# EAGLE design Posibus (EAGLE 6.6.0)
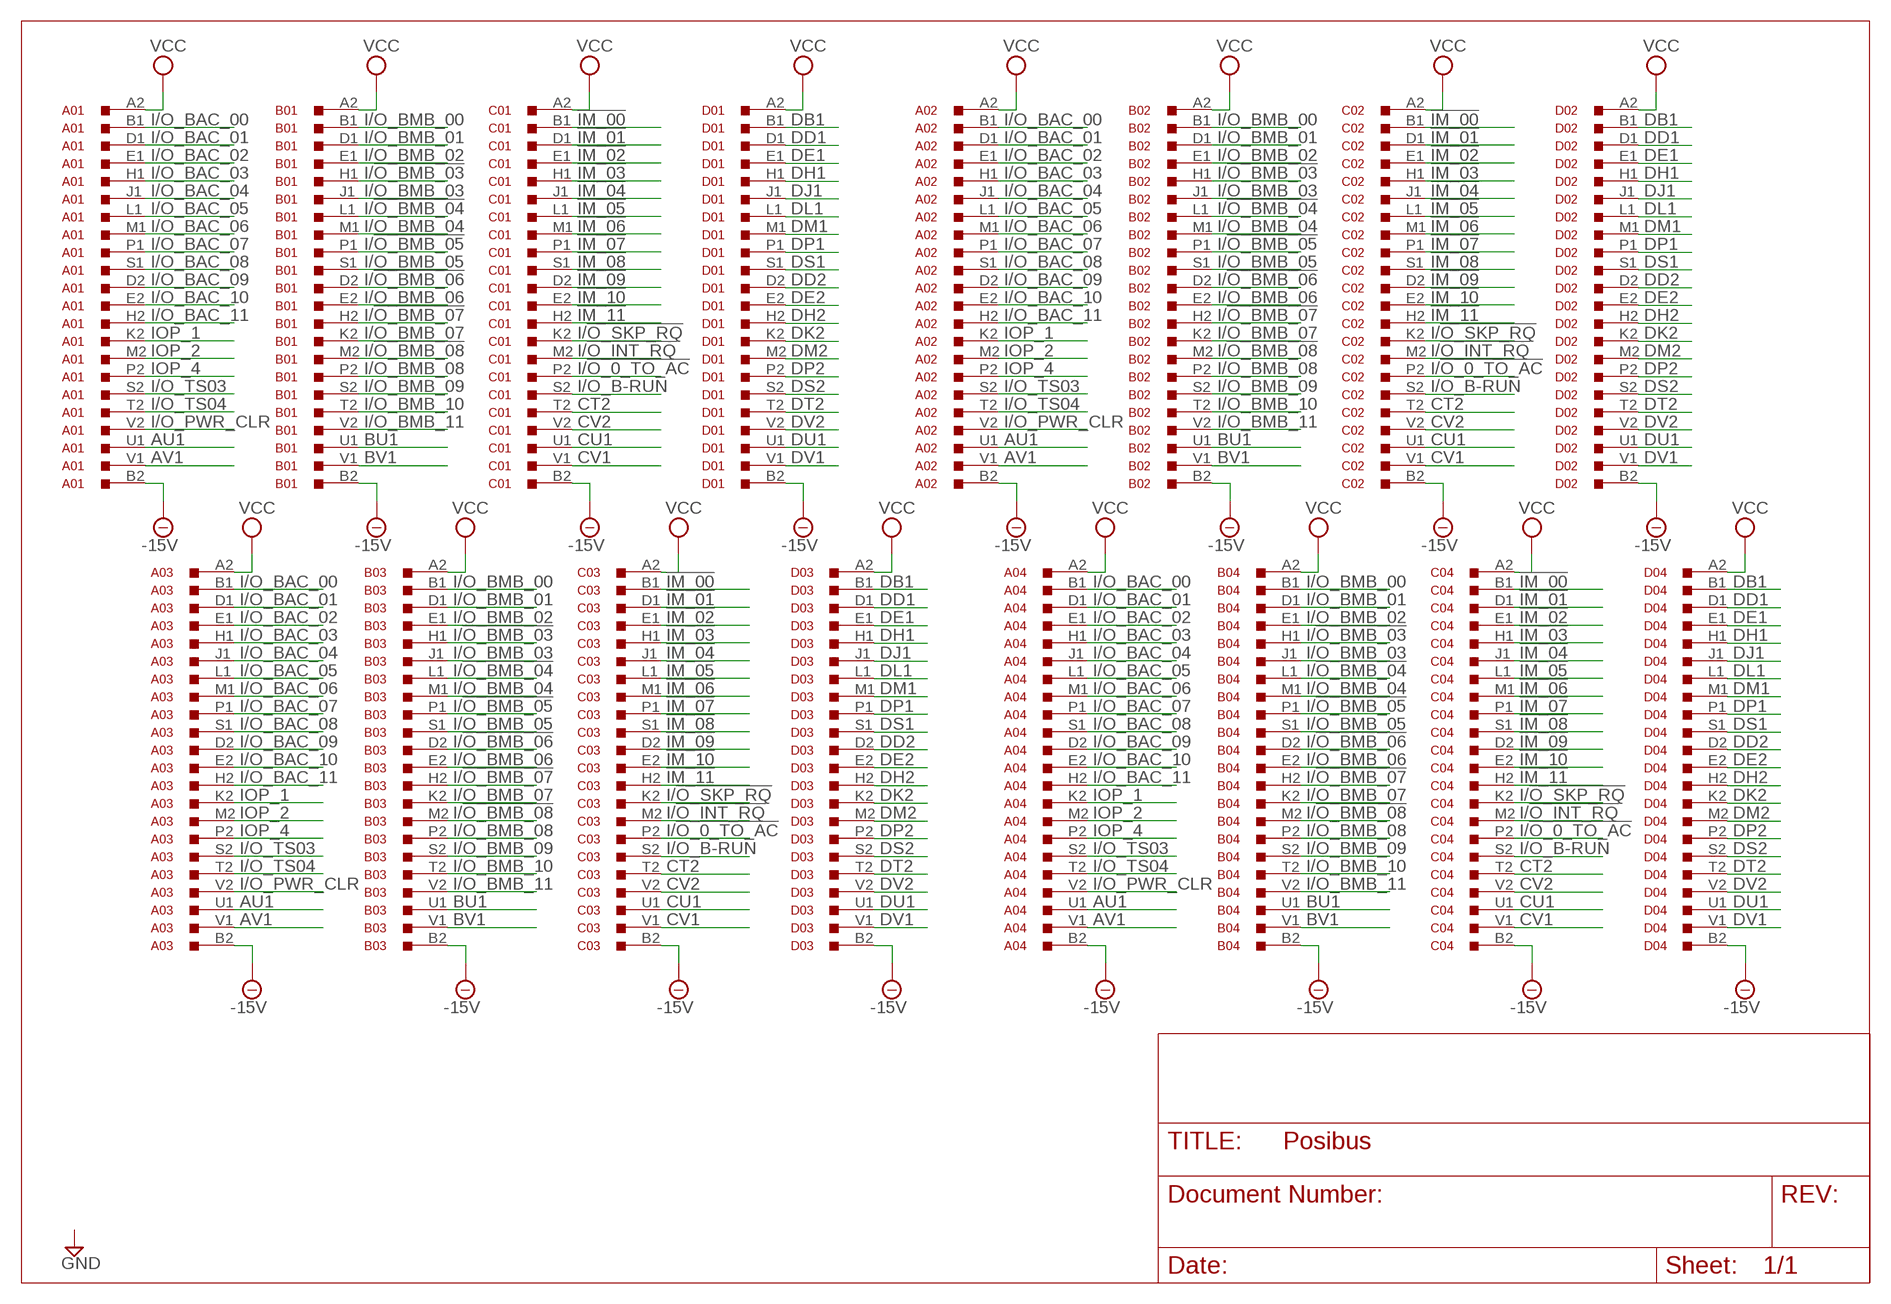
[diagram p0: schematic, sheet 1]

## Parts
A01  M903  [H807]
A02  M903  [H807]
A03  M903  [H807]
A04  M903  [H807]
B01  M903  [H807]
B02  M903  [H807]
B03  M903  [H807]
B04  M903  [H807]
C01  M903  [H807]
C02  M903  [H807]
C03  M903  [H807]
C04  M903  [H807]
D01  M903  [H807]
D02  M903  [H807]
D03  M903  [H807]
D04  M903  [H807]

## Nets
!IM_00: C01.B1 C02.B1 C03.B1 C04.B1
!IM_01: C01.D1 C02.D1 C03.D1 C04.D1
!IM_02: C01.E1 C02.E1 C03.E1 C04.E1
!IM_03: C01.H1 C02.H1 C03.H1 C04.H1
!IM_04: C01.J1 C02.J1 C03.J1 C04.J1
!IM_05: C01.L1 C02.L1 C03.L1 C04.L1
!IM_06: C01.M1 C02.M1 C03.M1 C04.M1
!IM_07: C01.P1 C02.P1 C03.P1 C04.P1
!IM_08: C01.S1 C02.S1 C03.S1 C04.S1
!IM_09: C01.D2 C02.D2 C03.D2 C04.D2
!IM_10: C01.E2 C02.E2 C03.E2 C04.E2
!IM_11: C01.H2 C02.H2 C03.H2 C04.H2
-15V: A01.B2 A02.B2 A03.B2 A04.B2 B01.B2 B02.B2 B03.B2 B04.B2 C01.B2 C02.B2 C03.B2 C04.B2 D01.B2 D02.B2 D03.B2 D04.B2
AU1: A01.U1 A02.U1 A03.U1 A04.U1
AV1: A01.V1 A02.V1 A03.V1 A04.V1
BU1: B01.U1 B02.U1 B03.U1 B04.U1
BV1: B01.V1 B02.V1 B03.V1 B04.V1
CT2: C01.T2 C02.T2 C03.T2 C04.T2
CU1: C01.U1 C02.U1 C03.U1 C04.U1
CV1: C01.V1 C02.V1 C03.V1 C04.V1
CV2: C01.V2 C02.V2 C03.V2 C04.V2
DB1: D01.B1 D02.B1 D03.B1 D04.B1
DD1: D01.D1 D02.D1 D03.D1 D04.D1
DD2: D01.D2 D02.D2 D03.D2 D04.D2
DE1: D01.E1 D02.E1 D03.E1 D04.E1
DE2: D01.E2 D02.E2 D03.E2 D04.E2
DH1: D01.H1 D02.H1 D03.H1 D04.H1
DH2: D01.H2 D02.H2 D03.H2 D04.H2
DJ1: D01.J1 D02.J1 D03.J1 D04.J1
DK2: D01.K2 D02.K2 D03.K2 D04.K2
DL1: D01.L1 D02.L1 D03.L1 D04.L1
DM1: D01.M1 D02.M1 D03.M1 D04.M1
DM2: D01.M2 D02.M2 D03.M2 D04.M2
DP1: D01.P1 D02.P1 D03.P1 D04.P1
DP2: D01.P2 D02.P2 D03.P2 D04.P2
DS1: D01.S1 D02.S1 D03.S1 D04.S1
DS2: D01.S2 D02.S2 D03.S2 D04.S2
DT2: D01.T2 D02.T2 D03.T2 D04.T2
DU1: D01.U1 D02.U1 D03.U1 D04.U1
DV1: D01.V1 D02.V1 D03.V1 D04.V1
DV2: D01.V2 D02.V2 D03.V2 D04.V2
I/!O_0_TO_AC: C01.P2 C02.P2 C03.P2 C04.P2
I/!O_BMB_03: B01.H1 B02.H1 B03.H1 B04.H1
I/!O_BMB_04: B01.L1 B02.L1 B03.L1 B04.L1
I/!O_BMB_05: B01.P1 B02.P1 B03.P1 B04.P1
I/!O_BMB_06: B01.D2 B02.D2 B03.D2 B04.D2
I/!O_BMB_07: B01.H2 B02.H2 B03.H2 B04.H2
I/!O_BMB_08: B01.M2 B02.M2 B03.M2 B04.M2
I/!O_INT_RQ: C01.M2 C02.M2 C03.M2 C04.M2
I/!O_SKP_RQ: C01.K2 C02.K2 C03.K2 C04.K2
I/O_B-RUN: C01.S2 C02.S2 C03.S2 C04.S2
I/O_BAC_00: A01.B1 A02.B1 A03.B1 A04.B1
I/O_BAC_01: A01.D1 A02.D1 A03.D1 A04.D1
I/O_BAC_02: A01.E1 A02.E1 A03.E1 A04.E1
I/O_BAC_03: A01.H1 A02.H1 A03.H1 A04.H1
I/O_BAC_04: A01.J1 A02.J1 A03.J1 A04.J1
I/O_BAC_05: A01.L1 A02.L1 A03.L1 A04.L1
I/O_BAC_06: A01.M1 A02.M1 A03.M1 A04.M1
I/O_BAC_07: A01.P1 A02.P1 A03.P1 A04.P1
I/O_BAC_08: A01.S1 A02.S1 A03.S1 A04.S1
I/O_BAC_09: A01.D2 A02.D2 A03.D2 A04.D2
I/O_BAC_10: A01.E2 A02.E2 A03.E2 A04.E2
I/O_BAC_11: A01.H2 A02.H2 A03.H2 A04.H2
I/O_BMB_00: B01.B1 B02.B1 B03.B1 B04.B1
I/O_BMB_01: B01.D1 B02.D1 B03.D1 B04.D1
I/O_BMB_02: B01.E1 B02.E1 B03.E1 B04.E1
I/O_BMB_03: B01.J1 B02.J1 B03.J1 B04.J1
I/O_BMB_04: B01.M1 B02.M1 B03.M1 B04.M1
I/O_BMB_05: B01.S1 B02.S1 B03.S1 B04.S1
I/O_BMB_06: B01.E2 B02.E2 B03.E2 B04.E2
I/O_BMB_07: B01.K2 B02.K2 B03.K2 B04.K2
I/O_BMB_08: B01.P2 B02.P2 B03.P2 B04.P2
I/O_BMB_09: B01.S2 B02.S2 B03.S2 B04.S2
I/O_BMB_10: B01.T2 B02.T2 B03.T2 B04.T2
I/O_BMB_11: B01.V2 B02.V2 B03.V2 B04.V2
I/O_PWR_CLR: A01.V2 A02.V2 A03.V2 A04.V2
I/O_TS03: A01.S2 A02.S2 A03.S2 A04.S2
I/O_TS04: A01.T2 A02.T2 A03.T2 A04.T2
IOP_1: A01.K2 A02.K2 A03.K2 A04.K2
IOP_2: A01.M2 A02.M2 A03.M2 A04.M2
IOP_4: A01.P2 A02.P2 A03.P2 A04.P2
VCC: A01.A2 A02.A2 A03.A2 A04.A2 B01.A2 B02.A2 B03.A2 B04.A2 C01.A2 C02.A2 C03.A2 C04.A2 D01.A2 D02.A2 D03.A2 D04.A2

## Power pins joined to a net without a drawn wire
GND: A01.A1 A01.C1 A01.C2 A01.F1 A01.F2 A01.J2 A01.K1 A01.L2 A01.N1 A01.N2 A01.R1 A01.R2 A01.T1 A01.U2 A02.A1 A02.C1 A02.C2 A02.F1 A02.F2 A02.J2 A02.K1 A02.L2 A02.N1 A02.N2 A02.R1 A02.R2 A02.T1 A02.U2 A03.A1 A03.C1 A03.C2 A03.F1 A03.F2 A03.J2 A03.K1 A03.L2 A03.N1 A03.N2 A03.R1 A03.R2 A03.T1 A03.U2 A04.A1 A04.C1 A04.C2 A04.F1 A04.F2 A04.J2 A04.K1 A04.L2 A04.N1 A04.N2 A04.R1 A04.R2 A04.T1 A04.U2 B01.A1 B01.C1 B01.C2 B01.F1 B01.F2 B01.J2 B01.K1 B01.L2 B01.N1 B01.N2 B01.R1 B01.R2 B01.T1 B01.U2 B02.A1 B02.C1 B02.C2 B02.F1 B02.F2 B02.J2 B02.K1 B02.L2 B02.N1 B02.N2 B02.R1 B02.R2 B02.T1 B02.U2 B03.A1 B03.C1 B03.C2 B03.F1 B03.F2 B03.J2 B03.K1 B03.L2 B03.N1 B03.N2 B03.R1 B03.R2 B03.T1 B03.U2 B04.A1 B04.C1 B04.C2 B04.F1 B04.F2 B04.J2 B04.K1 B04.L2 B04.N1 B04.N2 B04.R1 B04.R2 B04.T1 B04.U2 C01.A1 C01.C1 C01.C2 C01.F1 C01.F2 C01.J2 C01.K1 C01.L2 C01.N1 C01.N2 C01.R1 C01.R2 C01.T1 C01.U2 C02.A1 C02.C1 C02.C2 C02.F1 C02.F2 C02.J2 C02.K1 C02.L2 C02.N1 C02.N2 C02.R1 C02.R2 C02.T1 C02.U2 C03.A1 C03.C1 C03.C2 C03.F1 C03.F2 C03.J2 C03.K1 C03.L2 C03.N1 C03.N2 C03.R1 C03.R2 C03.T1 C03.U2 C04.A1 C04.C1 C04.C2 C04.F1 C04.F2 C04.J2 C04.K1 C04.L2 C04.N1 C04.N2 C04.R1 C04.R2 C04.T1 C04.U2 D01.A1 D01.C1 D01.C2 D01.F1 D01.F2 D01.J2 D01.K1 D01.L2 D01.N1 D01.N2 D01.R1 D01.R2 D01.T1 D01.U2 D02.A1 D02.C1 D02.C2 D02.F1 D02.F2 D02.J2 D02.K1 D02.L2 D02.N1 D02.N2 D02.R1 D02.R2 D02.T1 D02.U2 D03.A1 D03.C1 D03.C2 D03.F1 D03.F2 D03.J2 D03.K1 D03.L2 D03.N1 D03.N2 D03.R1 D03.R2 D03.T1 D03.U2 D04.A1 D04.C1 D04.C2 D04.F1 D04.F2 D04.J2 D04.K1 D04.L2 D04.N1 D04.N2 D04.R1 D04.R2 D04.T1 D04.U2

## Library data of the parts
A01-A04 B01-B04 C01-C04 D01-D04 = dec-m:M903: Two-sided Posibus cable/connector.

## Net classes
0 default: width 0.762 mm
1 Power: width 0.762 mm, drill 0.381 mm, clearance 0.381 mm

## Board
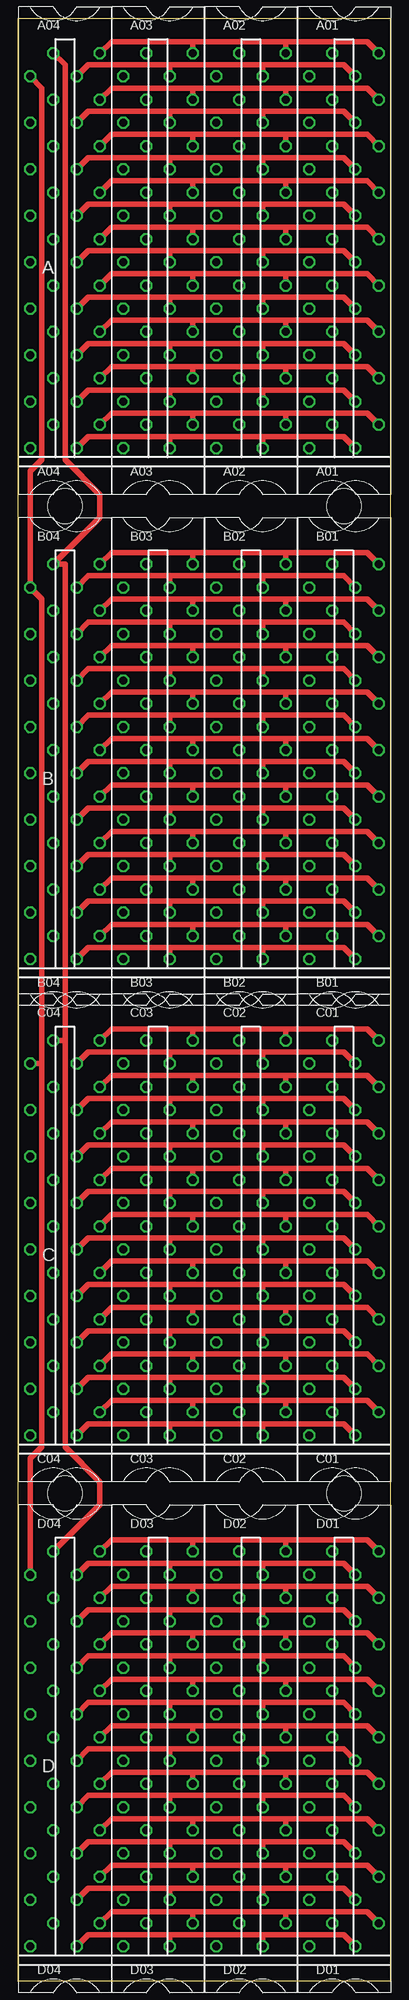
[diagram p1: board, top side]
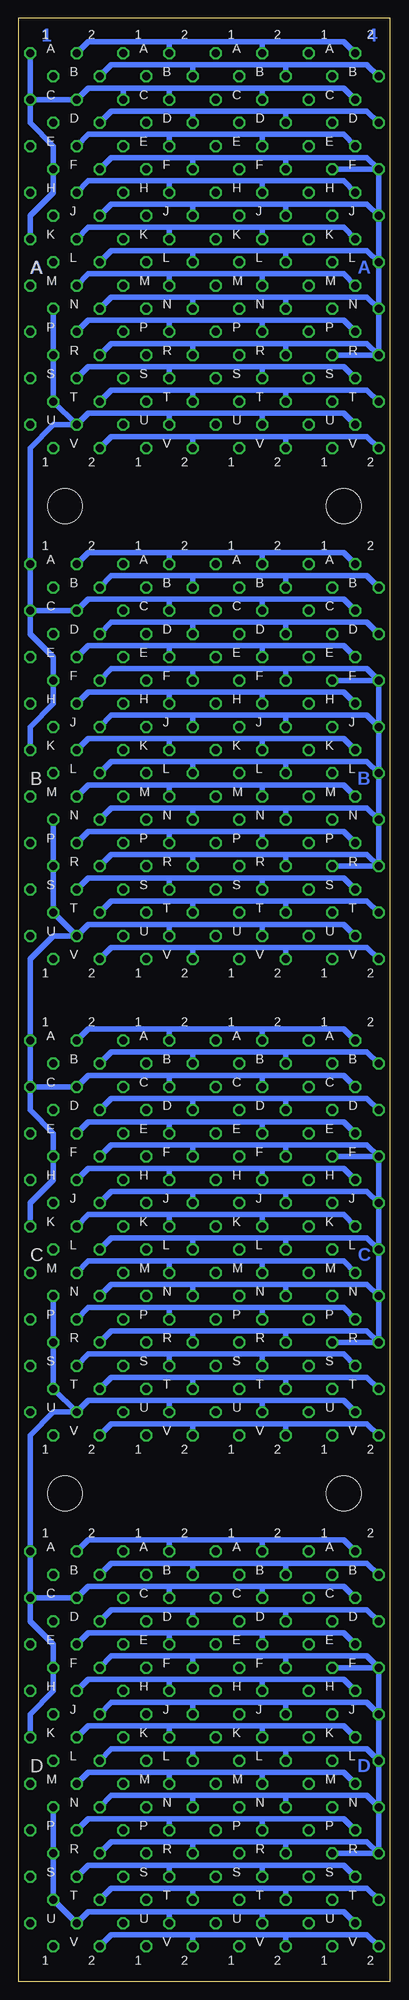
[diagram p2: board, bottom side, seen from below]

Size 50.86 x 268.27 mm. Coordinates in mm from the lower left corner, seen from the top.
Outline: 50.83,0 0,0 0.03,268.26 50.86,268.28 50.83,0
Copper layers (1*16): Top 0.035mm / dielectric 1.5mm / Bottom 0.035mm
Design rules "10mils *": minimum track width 10mil, minimum drill 24mil, track to track 10mil, track to pad 10mil, pad to pad 10mil, via to via 10mil, smd to smd 10mil, copper to edge 25mil, drill to drill 10mil, minimum pad ring 10mil, minimum via ring 8mil, stop-mask expansion 0mil, vias tented up to drill 0mil, thermal gap 10mil
Holes 4.76 mm at 44.49,201.6 6.39,201.6 6.39,66.66 44.49,66.66

### Footprints (pad centres in the part's own frame; a part is rotated, then mirrored left to right if it is on the bottom)
H807 = drill 1.092 octagon: A1 4.763,28.575; A2 -1.587,28.575; B1 1.587,25.4; B2 -4.763,25.4; C1 4.763,22.225; C2 -1.587,22.225; D1 1.587,19.05; D2 -4.763,19.05; E1 4.763,15.875; E2 -1.587,15.875; F1 1.587,12.7; F2 -4.763,12.7; H1 4.763,9.525; H2 -1.587,9.525; J1 1.587,6.35; J2 -4.763,6.35; K1 4.763,3.175; K2 -1.587,3.175; L1 1.587,0; L2 -4.763,0; M1 4.763,-3.175; M2 -1.587,-3.175; N1 1.587,-6.35; N2 -4.763,-6.35; P1 4.763,-9.525; P2 -1.587,-9.525; R1 1.587,-12.7; R2 -4.763,-12.7; S1 4.763,-15.875; S2 -1.587,-15.875; T1 1.587,-19.05; T2 -4.763,-19.05; U1 4.763,-22.225; U2 -1.587,-22.225; V1 1.587,-25.4; V2 -4.763,-25.4

### Placement (x,y rotation side)
A01  44.49,234.94 0 top
A02  31.79,234.94 0 top
A03  19.09,234.94 0 top
A04  6.39,234.94 0 top
B01  44.49,165.09 0 top
B02  31.79,165.09 0 top
B03  19.09,165.09 0 top
B04  6.39,165.09 0 top
C01  44.49,100 0 top
C02  31.79,100 0 top
C03  19.09,100 0 top
C04  6.39,100 0 top
D01  44.49,30.15 0 top
D02  31.79,30.15 0 top
D03  19.09,30.15 0 top
D04  6.39,30.15 0 top

### Tracks (layer width: path | path; a pad name or v marks a point on that pad's centre or on a via)
!IM_00
  Top 0.762: C04.B1 9.56,126.99 20.67,126.99 | 20.67,126.99 33.37,126.99 | 33.37,126.99 44.49,126.99 C01.B1 | C02.B1 33.37,126.99 | C03.B1 20.67,126.99
!IM_01
  Top 0.762: C04.D1 9.56,120.64 20.67,120.64 | 20.67,120.64 33.37,120.64 | 33.37,120.64 44.49,120.64 C01.D1 | C03.D1 20.67,120.64 | C02.D1 33.37,120.64
!IM_02
  Top 0.762: C04.E1 12.74,117.46 23.85,117.46 | 23.85,117.46 36.55,117.46 | 36.55,117.46 47.66,117.46 C01.E1 | C03.E1 23.85,117.46 | C02.E1 36.55,117.46
!IM_03
  Top 0.762: C01.H1 47.66,111.11 36.55,111.11 | 36.55,111.11 23.85,111.11 | 23.85,111.11 12.74,111.11 C04.H1 | C02.H1 36.55,111.11 | C03.H1 23.85,111.11
!IM_04
  Top 0.762: C04.J1 9.56,107.94 20.67,107.94 | 20.67,107.94 33.37,107.94 | 33.37,107.94 44.49,107.94 C01.J1 | C02.J1 33.37,107.94 | C03.J1 20.67,107.94
!IM_05
  Top 0.762: C04.L1 9.56,101.59 20.67,101.59 | 20.67,101.59 33.37,101.59 | 33.37,101.59 44.49,101.59 C01.L1 | C02.L1 33.37,101.59 | C03.L1 20.67,101.59
!IM_06
  Top 0.762: C01.M1 47.66,98.41 36.55,98.41 | 36.55,98.41 23.85,98.41 | 23.85,98.41 12.74,98.41 C04.M1 | C02.M1 36.55,98.41 | C03.M1 23.85,98.41
!IM_07
  Top 0.762: C04.P1 12.74,92.06 23.85,92.06 | 23.85,92.06 36.55,92.06 | 36.55,92.06 47.66,92.06 C01.P1 | C02.P1 36.55,92.06 | C03.P1 23.85,92.06
!IM_08
  Top 0.762: C01.S1 47.66,85.71 36.55,85.71 | 36.55,85.71 23.85,85.71 | 23.85,85.71 12.74,85.71 C04.S1 | C02.S1 36.55,85.71 | C03.S1 23.85,85.71
!IM_09
  Bottom 0.762: C04.D2 3.21,120.64 14.32,120.64 | 14.32,120.64 27.02,120.64 | 27.02,120.64 38.14,120.64 C01.D2 | C03.D2 14.32,120.64 | C02.D2 27.02,120.64
!IM_10
  Bottom 0.762: C04.E2 6.39,117.46 17.5,117.46 | 17.5,117.46 30.2,117.46 | 30.2,117.46 41.31,117.46 C01.E2 | C03.E2 17.5,117.46 | C02.E2 30.2,117.46
!IM_11
  Bottom 0.762: C01.H2 41.31,111.11 30.2,111.11 | 30.2,111.11 17.5,111.11 | 17.5,111.11 6.39,111.11 C04.H2 | C03.H2 17.5,111.11 | C02.H2 30.2,111.11
-15V
  Top 0.762: A04.B2 3.21,258.75 3.21,207.95 1.62,206.36 B04.B2 3.21,188.9 3.21,125.4 | D04.B2 1.62,71.43 3.21,73.01 3.21,125.4 | 3.21,125.4 C04.B2
  Bottom 0.762: 3.21,261.93 14.32,261.93 | 14.32,261.93 27.02,261.93 | 27.02,261.93 38.14,261.93 A01.B2 | A02.B2 27.02,261.93 | A03.B2 14.32,261.93 | D04.B2 3.21,57.14 14.32,57.14 | 14.32,57.14 27.02,57.14 | 27.02,57.14 38.14,57.14 D01.B2 | C04.B2 3.21,126.99 14.32,126.99 | 14.32,126.99 27.02,126.99 | 27.02,126.99 38.14,126.99 C01.B2 | B01.B2 38.14,192.08 27.02,192.08 | 27.02,192.08 14.32,192.08 | 14.32,192.08 3.21,192.08 B04.B2 | B03.B2 14.32,192.08 | B02.B2 27.02,192.08 | D02.B2 27.02,57.14 | D03.B2 14.32,57.14 | C03.B2 14.32,126.99 | C02.B2 27.02,126.99
  Bottom 0.813: A04.B2 3.21,261.93
AU1
  Top 0.762: A04.U1 12.74,214.3 23.85,214.3 | 23.85,214.3 36.55,214.3 | 36.55,214.3 47.66,214.3 A01.U1 | A02.U1 36.55,214.3 | A03.U1 23.85,214.3
AV1
  Top 0.762: A04.V1 9.56,211.12 20.67,211.12 | 20.67,211.12 33.37,211.12 | 33.37,211.12 44.49,211.12 A01.V1 | A03.V1 20.67,211.12 | A02.V1 33.37,211.12
BU1
  Top 0.762: B01.U1 47.66,144.45 36.55,144.45 | 36.55,144.45 23.85,144.45 | 23.85,144.45 12.74,144.45 B04.U1 | B02.U1 36.55,144.45 | B03.U1 23.85,144.45
BV1
  Top 0.762: B04.V1 9.56,141.27 20.67,141.27 | 20.67,141.27 33.37,141.27 | 33.37,141.27 44.49,141.27 B01.V1 | B03.V1 20.67,141.27 | B02.V1 33.37,141.27
CT2
  Bottom 0.762: C04.T2 3.21,82.54 14.32,82.54 | 14.32,82.54 27.02,82.54 | 27.02,82.54 38.14,82.54 C01.T2 | C03.T2 14.32,82.54 | C02.T2 27.02,82.54
CU1
  Top 0.762: C01.U1 47.66,79.36 36.55,79.36 | 36.55,79.36 23.85,79.36 | 23.85,79.36 12.74,79.36 C04.U1 | C02.U1 36.55,79.36 | C03.U1 23.85,79.36
CV1
  Top 0.762: C04.V1 9.56,76.19 20.67,76.19 | 20.67,76.19 33.37,76.19 | 33.37,76.19 44.49,76.19 C01.V1 | C02.V1 33.37,76.19 | C03.V1 20.67,76.19
CV2
  Bottom 0.762: C04.V2 3.21,76.19 14.32,76.19 | 14.32,76.19 27.02,76.19 | 27.02,76.19 38.14,76.19 C01.V2 | C03.V2 14.32,76.19 | C02.V2 27.02,76.19
DB1
  Top 0.762: D04.B1 9.56,57.14 20.67,57.14 | 20.67,57.14 33.37,57.14 | 33.37,57.14 44.49,57.14 D01.B1 | D03.B1 20.67,57.14 | D02.B1 33.37,57.14
DD1
  Top 0.762: D01.D1 44.49,50.79 33.37,50.79 | 33.37,50.79 20.67,50.79 | 20.67,50.79 9.56,50.79 D04.D1 | D03.D1 20.67,50.79 | D02.D1 33.37,50.79
DD2
  Bottom 0.762: D04.D2 3.21,50.79 14.32,50.79 | 14.32,50.79 27.02,50.79 | 27.02,50.79 38.14,50.79 D01.D2 | D02.D2 27.02,50.79 | D03.D2 14.32,50.79
DE1
  Top 0.762: D04.E1 12.74,47.61 23.85,47.61 | 23.85,47.61 36.55,47.61 | 36.55,47.61 47.66,47.61 D01.E1 | D03.E1 23.85,47.61 | D02.E1 36.55,47.61
DE2
  Bottom 0.762: D04.E2 6.39,47.61 17.5,47.61 | 17.5,47.61 30.2,47.61 | 30.2,47.61 41.31,47.61 D01.E2 | D03.E2 17.5,47.61 | D02.E2 30.2,47.61
DH1
  Top 0.762: D01.H1 47.66,41.26 36.55,41.26 | 36.55,41.26 23.85,41.26 | 23.85,41.26 12.74,41.26 D04.H1 | D03.H1 23.85,41.26 | D02.H1 36.55,41.26
DH2
  Bottom 0.762: D04.H2 6.39,41.26 17.5,41.26 | 17.5,41.26 30.2,41.26 | 30.2,41.26 41.31,41.26 D01.H2 | D03.H2 17.5,41.26 | D02.H2 30.2,41.26
DJ1
  Top 0.762: D04.J1 9.56,38.09 20.67,38.09 | 20.67,38.09 33.37,38.09 | 33.37,38.09 44.49,38.09 D01.J1 | D03.J1 20.67,38.09 | D02.J1 33.37,38.09
DK2
  Bottom 0.762: D04.K2 6.39,34.91 17.5,34.91 | 17.5,34.91 30.2,34.91 | 30.2,34.91 41.31,34.91 D01.K2 | D03.K2 17.5,34.91 | D02.K2 30.2,34.91
DL1
  Top 0.762: D04.L1 9.56,31.74 20.67,31.74 | 20.67,31.74 33.37,31.74 | 33.37,31.74 44.49,31.74 D01.L1 | D03.L1 20.67,31.74 | D02.L1 33.37,31.74
DM1
  Top 0.762: D04.M1 12.74,28.56 23.85,28.56 | 23.85,28.56 36.55,28.56 | 36.55,28.56 47.66,28.56 D01.M1 | D03.M1 23.85,28.56 | D02.M1 36.55,28.56
DM2
  Bottom 0.762: D04.M2 6.39,28.56 17.5,28.56 | 17.5,28.56 30.2,28.56 | 30.2,28.56 41.31,28.56 D01.M2 | D03.M2 17.5,28.56 | D02.M2 30.2,28.56
DP1
  Top 0.762: D01.P1 47.66,22.21 36.55,22.21 | 36.55,22.21 23.85,22.21 | 23.85,22.21 12.74,22.21 D04.P1 | D03.P1 23.85,22.21 | D02.P1 36.55,22.21
DP2
  Bottom 0.762: D04.P2 6.39,22.21 17.5,22.21 | 17.5,22.21 30.2,22.21 | 30.2,22.21 41.31,22.21 D01.P2 | D03.P2 17.5,22.21 | D02.P2 30.2,22.21
DS1
  Top 0.762: D01.S1 47.66,15.86 36.55,15.86 | 36.55,15.86 23.85,15.86 | 23.85,15.86 12.74,15.86 D04.S1 | D03.S1 23.85,15.86 | D02.S1 36.55,15.86
DS2
  Bottom 0.762: D04.S2 6.39,15.86 17.5,15.86 | 17.5,15.86 30.2,15.86 | 30.2,15.86 41.31,15.86 D01.S2 | D03.S2 17.5,15.86 | D02.S2 30.2,15.86
DT2
  Bottom 0.762: D04.T2 3.21,12.69 14.32,12.69 | 14.32,12.69 27.02,12.69 | 27.02,12.69 38.14,12.69 D01.T2 | D02.T2 27.02,12.69 | D03.T2 14.32,12.69
DU1
  Top 0.762: D04.U1 12.74,9.51 23.85,9.51 | 23.85,9.51 36.55,9.51 | 36.55,9.51 47.66,9.51 D01.U1 | D03.U1 23.85,9.51 | D02.U1 36.55,9.51
DV1
  Top 0.762: D04.V1 9.56,6.34 20.67,6.34 | 20.67,6.34 33.37,6.34 | 33.37,6.34 44.49,6.34 D01.V1 | D03.V1 20.67,6.34 | D02.V1 33.37,6.34
DV2
  Bottom 0.762: D04.V2 3.21,6.34 14.32,6.34 | 14.32,6.34 27.02,6.34 | 27.02,6.34 38.14,6.34 D01.V2 | D02.V2 27.02,6.34 | D03.V2 14.32,6.34
GND
  Top 0.762: A04.T1 9.56,217.48 20.67,217.48 | 20.67,217.48 33.37,217.48 | 33.37,217.48 44.49,217.48 A01.T1 | A04.R1 9.56,223.83 20.67,223.83 | 20.67,223.83 33.37,223.83 | 33.37,223.83 44.49,223.83 A01.R1 | A02.T1 33.37,217.48 | A03.T1 20.67,217.48 | A03.R1 20.67,223.83 | A02.R1 33.37,223.83 | A04.N1 9.56,230.18 20.67,230.18 | 20.67,230.18 33.37,230.18 | 33.37,230.18 44.49,230.18 A01.N1 | A04.F1 9.56,249.23 20.67,249.23 | 20.67,249.23 33.37,249.23 | 33.37,249.23 44.49,249.23 A01.F1 | A04.A1 12.74,265.1 23.85,265.1 | 23.85,265.1 36.55,265.1 | 36.55,265.1 47.66,265.1 A01.A1 | A04.C1 12.74,258.75 23.85,258.75 | 23.85,258.75 36.55,258.75 | 36.55,258.75 47.66,258.75 A01.C1 | A03.C1 23.85,258.75 | A02.C1 36.55,258.75 | A03.A1 23.85,265.1 | A02.A1 36.55,265.1 | A03.F1 20.67,249.23 | A02.F1 33.37,249.23 | A01.K1 47.66,239.7 36.55,239.7 | 36.55,239.7 23.85,239.7 | 23.85,239.7 12.74,239.7 A04.K1 | A03.K1 23.85,239.7 | A02.K1 36.55,239.7 | A03.N1 20.67,230.18 | A02.N1 33.37,230.18 | B04.A1 12.74,195.25 23.85,195.25 | 23.85,195.25 36.55,195.25 | 36.55,195.25 47.66,195.25 B01.A1 | B01.C1 47.66,188.9 36.55,188.9 | 36.55,188.9 23.85,188.9 | 23.85,188.9 12.74,188.9 B04.C1 | B01.K1 47.66,169.85 36.55,169.85 | 36.55,169.85 23.85,169.85 | 23.85,169.85 12.74,169.85 B04.K1 | B04.T1 9.56,147.62 20.67,147.62 | 20.67,147.62 33.37,147.62 | 33.37,147.62 44.49,147.62 B01.T1 | B04.R1 9.56,153.98 20.67,153.98 | 20.67,153.98 33.37,153.98 | 33.37,153.98 44.49,153.98 B01.R1 | B04.N1 9.56,160.33 20.67,160.33 | 20.67,160.33 33.37,160.33 | 33.37,160.33 44.49,160.33 B01.N1 | B04.F1 9.56,179.37 20.67,179.37 | 20.67,179.37 33.37,179.37 | 33.37,179.37 44.49,179.37 B01.F1 | B03.A1 23.85,195.25
  Top 0.762: B02.A1 36.55,195.25 | B02.C1 36.55,188.9 | B03.C1 23.85,188.9 | B03.K1 23.85,169.85 | B02.K1 36.55,169.85 | B03.T1 20.67,147.62 | B02.T1 33.37,147.62 | B03.R1 20.67,153.98 | B02.R1 33.37,153.98 | B03.N1 20.67,160.33 | B02.N1 33.37,160.33 | B03.F1 20.67,179.37 | B02.F1 33.37,179.37 | C04.A1 12.74,130.16 23.85,130.16 | 23.85,130.16 36.55,130.16 | 36.55,130.16 47.66,130.16 C01.A1 | C04.C1 12.74,123.81 23.85,123.81 | 23.85,123.81 36.55,123.81 | 36.55,123.81 47.66,123.81 C01.C1 | C04.F1 9.56,114.29 20.67,114.29 | 20.67,114.29 33.37,114.29 | 33.37,114.29 44.49,114.29 C01.F1 | C02.F1 33.37,114.29 | C03.F1 20.67,114.29 | C03.A1 23.85,130.16 | C02.A1 36.55,130.16 | C02.C1 36.55,123.81 | C03.C1 23.85,123.81 | C04.K1 12.74,104.76 23.85,104.76 | 23.85,104.76 36.55,104.76 | 36.55,104.76 47.66,104.76 C01.K1 | C04.N1 9.56,95.24 20.67,95.24 | 20.67,95.24 33.37,95.24 | 33.37,95.24 44.49,95.24 C01.N1 | C04.R1 9.56,88.89 20.67,88.89 | 20.67,88.89 33.37,88.89 | 33.37,88.89 44.49,88.89 C01.R1 | C04.T1 9.56,82.54 20.67,82.54 | 20.67,82.54 33.37,82.54 | 33.37,82.54 44.49,82.54 C01.T1 | D04.A1 12.74,60.31 23.85,60.31 | 23.85,60.31 36.55,60.31 | 36.55,60.31 47.66,60.31 D01.A1 | D01.C1 47.66,53.96 36.55,53.96 | 36.55,53.96 23.85,53.96 | 23.85,53.96 12.74,53.96 D04.C1 | D04.F1 9.56,44.44 20.67,44.44 | 20.67,44.44 33.37,44.44 | 33.37,44.44 44.49,44.44 D01.F1 | D01.K1 47.66,34.91 36.55,34.91 | 36.55,34.91 23.85,34.91 | 23.85,34.91 12.74,34.91 D04.K1 | D04.N1 9.56,25.39 20.67,25.39 | 20.67,25.39 33.37,25.39 | 33.37,25.39 44.49,25.39 D01.N1 | D04.R1 9.56,19.04 20.67,19.04 | 20.67,19.04 33.37,19.04 | 33.37,19.04 44.49,19.04 D01.R1 | D04.T1 9.56,12.69 20.67,12.69 | 20.67,12.69 33.37,12.69
  Top 0.762: 33.37,12.69 44.49,12.69 D01.T1 | D03.T1 20.67,12.69 | D03.R1 20.67,19.04 | D03.N1 20.67,25.39 | D03.F1 20.67,44.44 | D03.A1 23.85,60.31 | D03.C1 23.85,53.96 | D03.K1 23.85,34.91 | D02.T1 33.37,12.69 | D02.R1 33.37,19.04 | D02.N1 33.37,25.39 | D02.K1 36.55,34.91 | D02.F1 33.37,44.44 | D02.C1 36.55,53.96 | D02.A1 36.55,60.31 | C02.T1 33.37,82.54 | C02.R1 33.37,88.89 | C02.N1 33.37,95.24 | C02.K1 36.55,104.76 | C03.K1 23.85,104.76 | C03.N1 20.67,95.24 | C03.R1 20.67,88.89 | C03.T1 20.67,82.54
  Bottom 0.762: A04.C2 6.39,258.75 17.5,258.75 | 17.5,258.75 30.2,258.75 | 30.2,258.75 36.55,258.75 | 36.55,258.75 41.31,258.75 A01.C2 A01.C1 | A02.C1 36.55,258.75 | A02.C2 30.2,258.75 | A04.F2 3.21,249.23 14.32,249.23 | 14.32,249.23 27.02,249.23 | 27.02,249.23 38.14,249.23 A01.F2 | A04.J2 3.21,242.87 14.32,242.87 | 14.32,242.87 27.02,242.87 | 27.02,242.87 38.14,242.87 A01.J2 | A04.L2 3.21,236.52 14.32,236.52 | 14.32,236.52 27.02,236.52 | 27.02,236.52 38.14,236.52 A01.L2 | A04.U2 6.39,214.3 17.5,214.3 | 17.5,214.3 30.2,214.3 | 30.2,214.3 41.31,214.3 A01.U2 | A03.U2 17.5,214.3 | A02.U2 30.2,214.3 | A04.R2 3.21,223.83 14.32,223.83 | 14.32,223.83 27.02,223.83 | 27.02,223.83 38.14,223.83 A01.R2 | A04.N2 3.21,230.18 14.32,230.18 | 14.32,230.18 27.02,230.18 | 27.02,230.18 38.14,230.18 A01.N2 | A02.F2 27.02,249.23 | A03.F2 14.32,249.23 | A03.J2 14.32,242.87 | A02.J2 27.02,242.87 | A02.L2 27.02,236.52 | A03.L2 14.32,236.52 | A03.N2 14.32,230.18 | A02.N2 27.02,230.18 | A04.F1 A04.F2 | A04.R2 A04.N2 | A04.N2 A04.L2 | A04.F2 A04.J2 | A04.J2 A04.L2 | A03.R2 14.32,223.83 | A02.R2 27.02,223.83 | A01.N1 A01.R1 A01.T1 A01.U2 | A01.C1 A01.A1 | A03.C2 17.5,258.75 | A04.R1 A04.R2 | A01.C1 49.25,253.99 46.07,250.81 A01.F1 46.07,244.46 49.25,241.29 A01.K1 | D04.U2 6.39,9.51 17.5,9.51 | 17.5,9.51 30.2,9.51 | 30.2,9.51 41.31,9.51 D01.U2 D01.T1 D01.R1 D01.N1 | D01.R2 38.14,19.04 27.02,19.04 | 27.02,19.04 14.32,19.04 | 14.32,19.04 3.21,19.04 D04.R2 | D04.N2 3.21,25.39 14.32,25.39 | 14.32,25.39 27.02,25.39 | 27.02,25.39 38.14,25.39 D01.N2 | D01.L2 38.14,31.74 27.02,31.74 | 27.02,31.74 14.32,31.74 | 14.32,31.74 3.21,31.74 D04.L2 | D04.J2 3.21,38.09 14.32,38.09 | 14.32,38.09 27.02,38.09 | 27.02,38.09 38.14,38.09 D01.J2
  Bottom 0.762: D01.F2 38.14,44.44 27.02,44.44 | 27.02,44.44 14.32,44.44 | 14.32,44.44 3.21,44.44 D04.F2 | C04.R2 3.21,88.89 14.32,88.89 | 14.32,88.89 27.02,88.89 | 27.02,88.89 38.14,88.89 C01.R2 | C04.N2 3.21,95.24 14.32,95.24 | 14.32,95.24 27.02,95.24 | 27.02,95.24 38.14,95.24 C01.N2 | C01.L2 38.14,101.59 27.02,101.59 | 27.02,101.59 14.32,101.59 | 14.32,101.59 3.21,101.59 C04.L2 | C04.J2 3.21,107.94 14.32,107.94 | 14.32,107.94 27.02,107.94 | 27.02,107.94 38.14,107.94 C01.J2 | C01.F2 38.14,114.29 27.02,114.29 | 27.02,114.29 14.32,114.29 | 14.32,114.29 3.21,114.29 C04.F2 | B04.R2 3.21,153.98 14.32,153.98 | 14.32,153.98 27.02,153.98 | 27.02,153.98 38.14,153.98 B01.R2 | B01.N2 38.14,160.33 27.02,160.33 | 27.02,160.33 14.32,160.33 | 14.32,160.33 3.21,160.33 B04.N2 | B04.L2 3.21,166.68 14.32,166.68 | 14.32,166.68 27.02,166.68 | 27.02,166.68 38.14,166.68 B01.L2 | B01.J2 38.14,173.02 27.02,173.02 | 27.02,173.02 14.32,173.02 | 14.32,173.02 3.21,173.02 B04.J2 | B04.F2 3.21,179.37 14.32,179.37 | 14.32,179.37 27.02,179.37 | 27.02,179.37 38.14,179.37 B01.F2 | B03.F2 14.32,179.37 | B03.J2 14.32,173.02 | B02.J2 27.02,173.02 | B02.F2 27.02,179.37 | B03.R2 14.32,153.98 | B03.N2 14.32,160.33 | B02.N2 27.02,160.33 | B02.R2 27.02,153.98 | B04.C2 6.39,188.9 17.5,188.9 | 17.5,188.9 30.2,188.9 | 30.2,188.9 41.31,188.9 B01.C2 B01.C1 | B03.C2 17.5,188.9 | B02.C2 30.2,188.9 | B03.L2 14.32,166.68 | B02.L2 27.02,166.68 | B01.U2 41.31,144.45 30.2,144.45 | 30.2,144.45 17.5,144.45 | 17.5,144.45 6.39,144.45 B04.U2 | B03.U2 17.5,144.45 | B02.U2 30.2,144.45 | C04.C2 6.39,123.81 17.5,123.81 | 17.5,123.81 30.2,123.81 | 30.2,123.81 41.31,123.81 C01.C2 C01.C1 | C04.U2 6.39,79.36 17.5,79.36 | 17.5,79.36 30.2,79.36
  Bottom 0.762: 30.2,79.36 41.31,79.36 C01.U2 | D04.C2 6.39,53.96 17.5,53.96 | 17.5,53.96 30.2,53.96 | 30.2,53.96 41.31,53.96 D01.C2 D01.C1 | C03.C2 17.5,123.81 | C02.C2 30.2,123.81 | C02.U2 30.2,79.36 | C03.U2 17.5,79.36 | D03.C2 17.5,53.96 | D03.U2 17.5,9.51 | D02.R2 27.02,19.04 | D02.N2 27.02,25.39 | D02.L2 27.02,31.74 | D02.J2 27.02,38.09 | D02.F2 27.02,44.44 | D02.C2 30.2,53.96 | D02.U2 30.2,9.51 | D03.R2 14.32,19.04 | D03.N2 14.32,25.39 | D03.L2 14.32,31.74 | D03.J2 14.32,38.09 | D03.F2 14.32,44.44 | C03.R2 14.32,88.89 | C03.N2 14.32,95.24 | C03.L2 14.32,101.59 | C03.J2 14.32,107.94 | C03.F2 14.32,114.29 | C02.R2 27.02,88.89 | C02.N2 27.02,95.24 | C02.L2 27.02,101.59 | C02.J2 27.02,107.94 | C02.F2 27.02,114.29 | B04.R2 B04.N2 | B04.N2 B04.L2 | B04.J2 B04.L2 | B04.F2 B04.J2 | C04.R2 C04.N2 | C04.N2 C04.L2 | C04.L2 C04.J2 | C04.J2 C04.F2 | D04.R2 D04.N2 | D04.N2 D04.L2 | D04.L2 D04.J2 | D04.J2 D04.F2 | B01.C1 B01.A1 49.25,209.54 46.07,212.71 A01.U2 | B01.C1 49.25,184.14 46.07,180.96 B01.F1 46.07,174.61 49.25,171.44 B01.K1 | C01.C1 C01.A1 49.25,139.69 46.07,142.86 B01.U2 | C01.K1 49.25,106.35 46.07,109.52 C01.F1 46.07,115.88 49.25,119.05 C01.C1 | C01.U2 46.07,77.77 49.25,74.6 D01.A1 D01.C1 | B01.N1 B01.R1 B01.T1 B01.U2 | C01.N1 C01.R1 C01.T1 C01.U2 | B04.F2 B04.F1 | C04.F1 C04.F2 | D04.F2 D04.F1 | D01.C1 49.25,49.2 46.07,46.03 D01.F1 46.07,39.68 49.25,36.5 D01.K1 | B04.R1 B04.R2 | C04.R1 C04.R2 | D04.R1 D04.R2
I/!O_0_TO_AC
  Bottom 0.762: C04.P2 6.39,92.06 17.5,92.06 | 17.5,92.06 30.2,92.06 | 30.2,92.06 41.31,92.06 C01.P2 | C02.P2 30.2,92.06 | C03.P2 17.5,92.06
I/!O_BMB_03
  Top 0.762: B04.H1 12.74,176.2 23.85,176.2 | 23.85,176.2 36.55,176.2 | 36.55,176.2 47.66,176.2 B01.H1 | B02.H1 36.55,176.2 | B03.H1 23.85,176.2
I/!O_BMB_04
  Top 0.762: B04.L1 9.56,166.68 20.67,166.68 | 20.67,166.68 33.37,166.68 | 33.37,166.68 44.49,166.68 B01.L1 | B03.L1 20.67,166.68 | B02.L1 33.37,166.68
I/!O_BMB_05
  Top 0.762: B01.P1 47.66,157.15 36.55,157.15 | 36.55,157.15 23.85,157.15 | 23.85,157.15 12.74,157.15 B04.P1 | B03.P1 23.85,157.15 | B02.P1 36.55,157.15
I/!O_BMB_06
  Bottom 0.762: B01.D2 38.14,185.73 27.02,185.73 | 27.02,185.73 14.32,185.73 | 14.32,185.73 3.21,185.73 B04.D2 | B03.D2 14.32,185.73 | B02.D2 27.02,185.73
I/!O_BMB_07
  Bottom 0.762: B04.H2 6.39,176.2 17.5,176.2 | 17.5,176.2 30.2,176.2 | 30.2,176.2 41.31,176.2 B01.H2 | B02.H2 30.2,176.2 | B03.H2 17.5,176.2
I/!O_BMB_08
  Bottom 0.762: B04.M2 6.39,163.5 17.5,163.5 | 17.5,163.5 30.2,163.5 | 30.2,163.5 41.31,163.5 B01.M2 | B02.M2 30.2,163.5 | B03.M2 17.5,163.5
I/!O_INT_RQ
  Bottom 0.762: C04.M2 6.39,98.41 17.5,98.41 | 17.5,98.41 30.2,98.41 | 30.2,98.41 41.31,98.41 C01.M2 | C03.M2 17.5,98.41 | C02.M2 30.2,98.41
I/!O_SKP_RQ
  Bottom 0.762: C04.K2 6.39,104.76 17.5,104.76 | 17.5,104.76 30.2,104.76 | 30.2,104.76 41.31,104.76 C01.K2 | C03.K2 17.5,104.76 | C02.K2 30.2,104.76
I/O_B-RUN
  Bottom 0.762: C04.S2 6.39,85.71 17.5,85.71 | 17.5,85.71 30.2,85.71 | 30.2,85.71 41.31,85.71 C01.S2 | C03.S2 17.5,85.71 | C02.S2 30.2,85.71
I/O_BAC_00
  Top 0.762: A01.B1 44.49,261.93 33.37,261.93 | 33.37,261.93 20.67,261.93 | 20.67,261.93 9.56,261.93 A04.B1 | A02.B1 33.37,261.93 | A03.B1 20.67,261.93
I/O_BAC_01
  Top 0.762: A04.D1 9.56,255.58 20.67,255.58 | 20.67,255.58 33.37,255.58 | 33.37,255.58 44.49,255.58 A01.D1 | A03.D1 20.67,255.58 | A02.D1 33.37,255.58
I/O_BAC_02
  Top 0.762: A04.E1 12.74,252.4 23.85,252.4 | 23.85,252.4 36.55,252.4 | 36.55,252.4 47.66,252.4 A01.E1 | A02.E1 36.55,252.4 | A03.E1 23.85,252.4
I/O_BAC_03
  Top 0.762: A04.H1 12.74,246.05 23.85,246.05 | 23.85,246.05 36.55,246.05 | 36.55,246.05 47.66,246.05 A01.H1 | A03.H1 23.85,246.05 | A02.H1 36.55,246.05
I/O_BAC_04
  Top 0.762: A04.J1 9.56,242.87 20.67,242.87 | 20.67,242.87 33.37,242.87 | 33.37,242.87 44.49,242.87 A01.J1 | A03.J1 20.67,242.87 | A02.J1 33.37,242.87
I/O_BAC_05
  Top 0.762: A04.L1 9.56,236.52 20.67,236.52 | 20.67,236.52 33.37,236.52 | 33.37,236.52 44.49,236.52 A01.L1 | A03.L1 20.67,236.52 | A02.L1 33.37,236.52
I/O_BAC_06
  Top 0.762: A04.M1 12.74,233.35 23.85,233.35 | 23.85,233.35 36.55,233.35 | 36.55,233.35 47.66,233.35 A01.M1 | A02.M1 36.55,233.35 | A03.M1 23.85,233.35
I/O_BAC_07
  Top 0.762: A01.P1 47.66,227 36.55,227 | 36.55,227 23.85,227 | 23.85,227 12.74,227 A04.P1 | A03.P1 23.85,227 | A02.P1 36.55,227
I/O_BAC_08
  Top 0.762: A01.S1 47.66,220.65 36.55,220.65 | 36.55,220.65 23.85,220.65 | 23.85,220.65 12.74,220.65 A04.S1 | A03.S1 23.85,220.65 | A02.S1 36.55,220.65
I/O_BAC_09
  Bottom 0.762: A04.D2 3.21,255.58 14.32,255.58 | A03.D2 14.32,255.58 | 14.32,255.58 27.02,255.58 | 27.02,255.58 38.14,255.58 A01.D2 | A02.D2 27.02,255.58
I/O_BAC_10
  Bottom 0.762: A04.E2 6.39,252.4 17.5,252.4 | 17.5,252.4 30.2,252.4 | 30.2,252.4 41.31,252.4 A01.E2 | A03.E2 17.5,252.4 | A02.E2 30.2,252.4
I/O_BAC_11
  Bottom 0.762: A04.H2 6.39,246.05 17.5,246.05 | 17.5,246.05 30.2,246.05 | 30.2,246.05 41.31,246.05 A01.H2 | A02.H2 30.2,246.05 | A03.H2 17.5,246.05
I/O_BMB_00
  Top 0.762: B04.B1 9.56,192.08 20.67,192.08 | 20.67,192.08 33.37,192.08 | 33.37,192.08 44.49,192.08 B01.B1 | B03.B1 20.67,192.08 | B02.B1 33.37,192.08
I/O_BMB_01
  Top 0.762: B04.D1 9.56,185.73 20.67,185.73 | 20.67,185.73 33.37,185.73 | 33.37,185.73 44.49,185.73 B01.D1 | B03.D1 20.67,185.73 | B02.D1 33.37,185.73
I/O_BMB_02
  Top 0.762: B04.E1 12.74,182.55 23.85,182.55 | 23.85,182.55 36.55,182.55 | 36.55,182.55 47.66,182.55 B01.E1 | B03.E1 23.85,182.55 | B02.E1 36.55,182.55
I/O_BMB_03
  Top 0.762: B04.J1 9.56,173.02 20.67,173.02 | 20.67,173.02 33.37,173.02 | 33.37,173.02 44.49,173.02 B01.J1 | B03.J1 20.67,173.02 | B02.J1 33.37,173.02
I/O_BMB_04
  Top 0.762: B04.M1 12.74,163.5 23.85,163.5 | 23.85,163.5 36.55,163.5 | 36.55,163.5 47.66,163.5 B01.M1 | B02.M1 36.55,163.5 | B03.M1 23.85,163.5
I/O_BMB_05
  Top 0.762: B04.S1 12.74,150.8 23.85,150.8 | 23.85,150.8 36.55,150.8 | 36.55,150.8 47.66,150.8 B01.S1 | B03.S1 23.85,150.8 | B02.S1 36.55,150.8
I/O_BMB_06
  Bottom 0.762: B04.E2 6.39,182.55 17.5,182.55 | 17.5,182.55 30.2,182.55 | 30.2,182.55 41.31,182.55 B01.E2 | B02.E2 30.2,182.55 | B03.E2 17.5,182.55
I/O_BMB_07
  Bottom 0.762: B04.K2 6.39,169.85 17.5,169.85 | 17.5,169.85 30.2,169.85 | 30.2,169.85 41.31,169.85 B01.K2 | B02.K2 30.2,169.85 | B03.K2 17.5,169.85
I/O_BMB_08
  Bottom 0.762: B04.P2 6.39,157.15 17.5,157.15 | 17.5,157.15 30.2,157.15 | 30.2,157.15 41.31,157.15 B01.P2 | B02.P2 30.2,157.15 | B03.P2 17.5,157.15
I/O_BMB_09
  Bottom 0.762: B04.S2 6.39,150.8 17.5,150.8 | 17.5,150.8 30.2,150.8 | 30.2,150.8 41.31,150.8 B01.S2 | B02.S2 30.2,150.8 | B03.S2 17.5,150.8
I/O_BMB_10
  Bottom 0.762: B01.T2 38.14,147.62 27.02,147.62 | 27.02,147.62 14.32,147.62 | 14.32,147.62 3.21,147.62 B04.T2 | B02.T2 27.02,147.62 | B03.T2 14.32,147.62
I/O_BMB_11
  Bottom 0.762: B04.V2 3.21,141.27 14.32,141.27 | 14.32,141.27 27.02,141.27 | 27.02,141.27 38.14,141.27 B01.V2 | B02.V2 27.02,141.27 | B03.V2 14.32,141.27
I/O_PWR_CLR
  Bottom 0.762: A04.V2 3.21,211.12 14.32,211.12 | A03.V2 14.32,211.12 | 14.32,211.12 27.02,211.12 | A02.V2 27.02,211.12 | 27.02,211.12 38.14,211.12 A01.V2
I/O_TS03
  Bottom 0.762: A04.S2 6.39,220.65 17.5,220.65 | 17.5,220.65 30.2,220.65 | 30.2,220.65 41.31,220.65 A01.S2 | A02.S2 30.2,220.65 | A03.S2 17.5,220.65
I/O_TS04
  Bottom 0.762: A04.T2 3.21,217.48 14.32,217.48 | 14.32,217.48 27.02,217.48 | 27.02,217.48 38.14,217.48 A01.T2 | A03.T2 14.32,217.48 | A02.T2 27.02,217.48
IOP_1
  Bottom 0.762: A04.K2 6.39,239.7 17.5,239.7 | 17.5,239.7 30.2,239.7 | 30.2,239.7 41.31,239.7 A01.K2 | A02.K2 30.2,239.7 | A03.K2 17.5,239.7
IOP_2
  Bottom 0.762: A04.M2 6.39,233.35 17.5,233.35 | 17.5,233.35 30.2,233.35 | 30.2,233.35 41.31,233.35 A01.M2 | A02.M2 30.2,233.35 | A03.M2 17.5,233.35
IOP_4
  Bottom 0.762: A04.P2 6.39,227 17.5,227 | 17.5,227 30.2,227 | 30.2,227 41.31,227 A01.P2 | A03.P2 17.5,227 | A02.P2 30.2,227
VCC
  Top 0.762: D04.A2 11.15,65.08 11.15,68.25 6.39,73.01 6.39,128.58 | C04.A2 6.39,128.58 | 6.39,128.58 6.39,193.66 B04.A2 11.15,200.01 11.15,203.19 6.39,207.95 6.39,261.93 A04.A2
  Bottom 0.762: A04.A2 6.39,265.1 17.5,265.1 | A03.A2 17.5,265.1 | 17.5,265.1 30.2,265.1 | A02.A2 30.2,265.1 | 30.2,265.1 41.31,265.1 A01.A2 | B04.A2 6.39,195.25 17.5,195.25 | 17.5,195.25 30.2,195.25 | 30.2,195.25 41.31,195.25 B01.A2 | B02.A2 30.2,195.25 | B03.A2 17.5,195.25 | C04.A2 6.39,130.16 17.5,130.16 | 17.5,130.16 30.2,130.16 | 30.2,130.16 41.31,130.16 C01.A2 | D04.A2 6.39,60.31 17.5,60.31 | 17.5,60.31 30.2,60.31 | 30.2,60.31 41.31,60.31 D01.A2 | C03.A2 17.5,130.16 | C02.A2 30.2,130.16 | D03.A2 17.5,60.31 | D02.A2 30.2,60.31

### Text on the board
Bottom: 4 | 1 | A | A | B | C | D
tPlace: 4 | 3 | 2 | 1 | A | B | C | D
bPlace: A | B | C | D | 4 | 3 | 2 | 1